# EasyEDA Pro project ProPrj_Frequency Generator for Healing_2026-01-01.epro

# Schematic ProPrj_Frequency Generator for Healing_2025-11-21
Board Name: ProPrj_Frequency Generator for Healing_2025-11-21; Create Date: 2025-11-24; Page Name: ProPrj_Frequency Generator for Healing_2025-11-21; Project Name: Frequency Generator for Healing; Schematic Name: ProPrj_Frequency Generator for Healing_2025-11-21; Update Date: 2025-12-26; File: ProPrj_Frequency Generator for Healing_2025-11-21; Id: /; Sheet: /
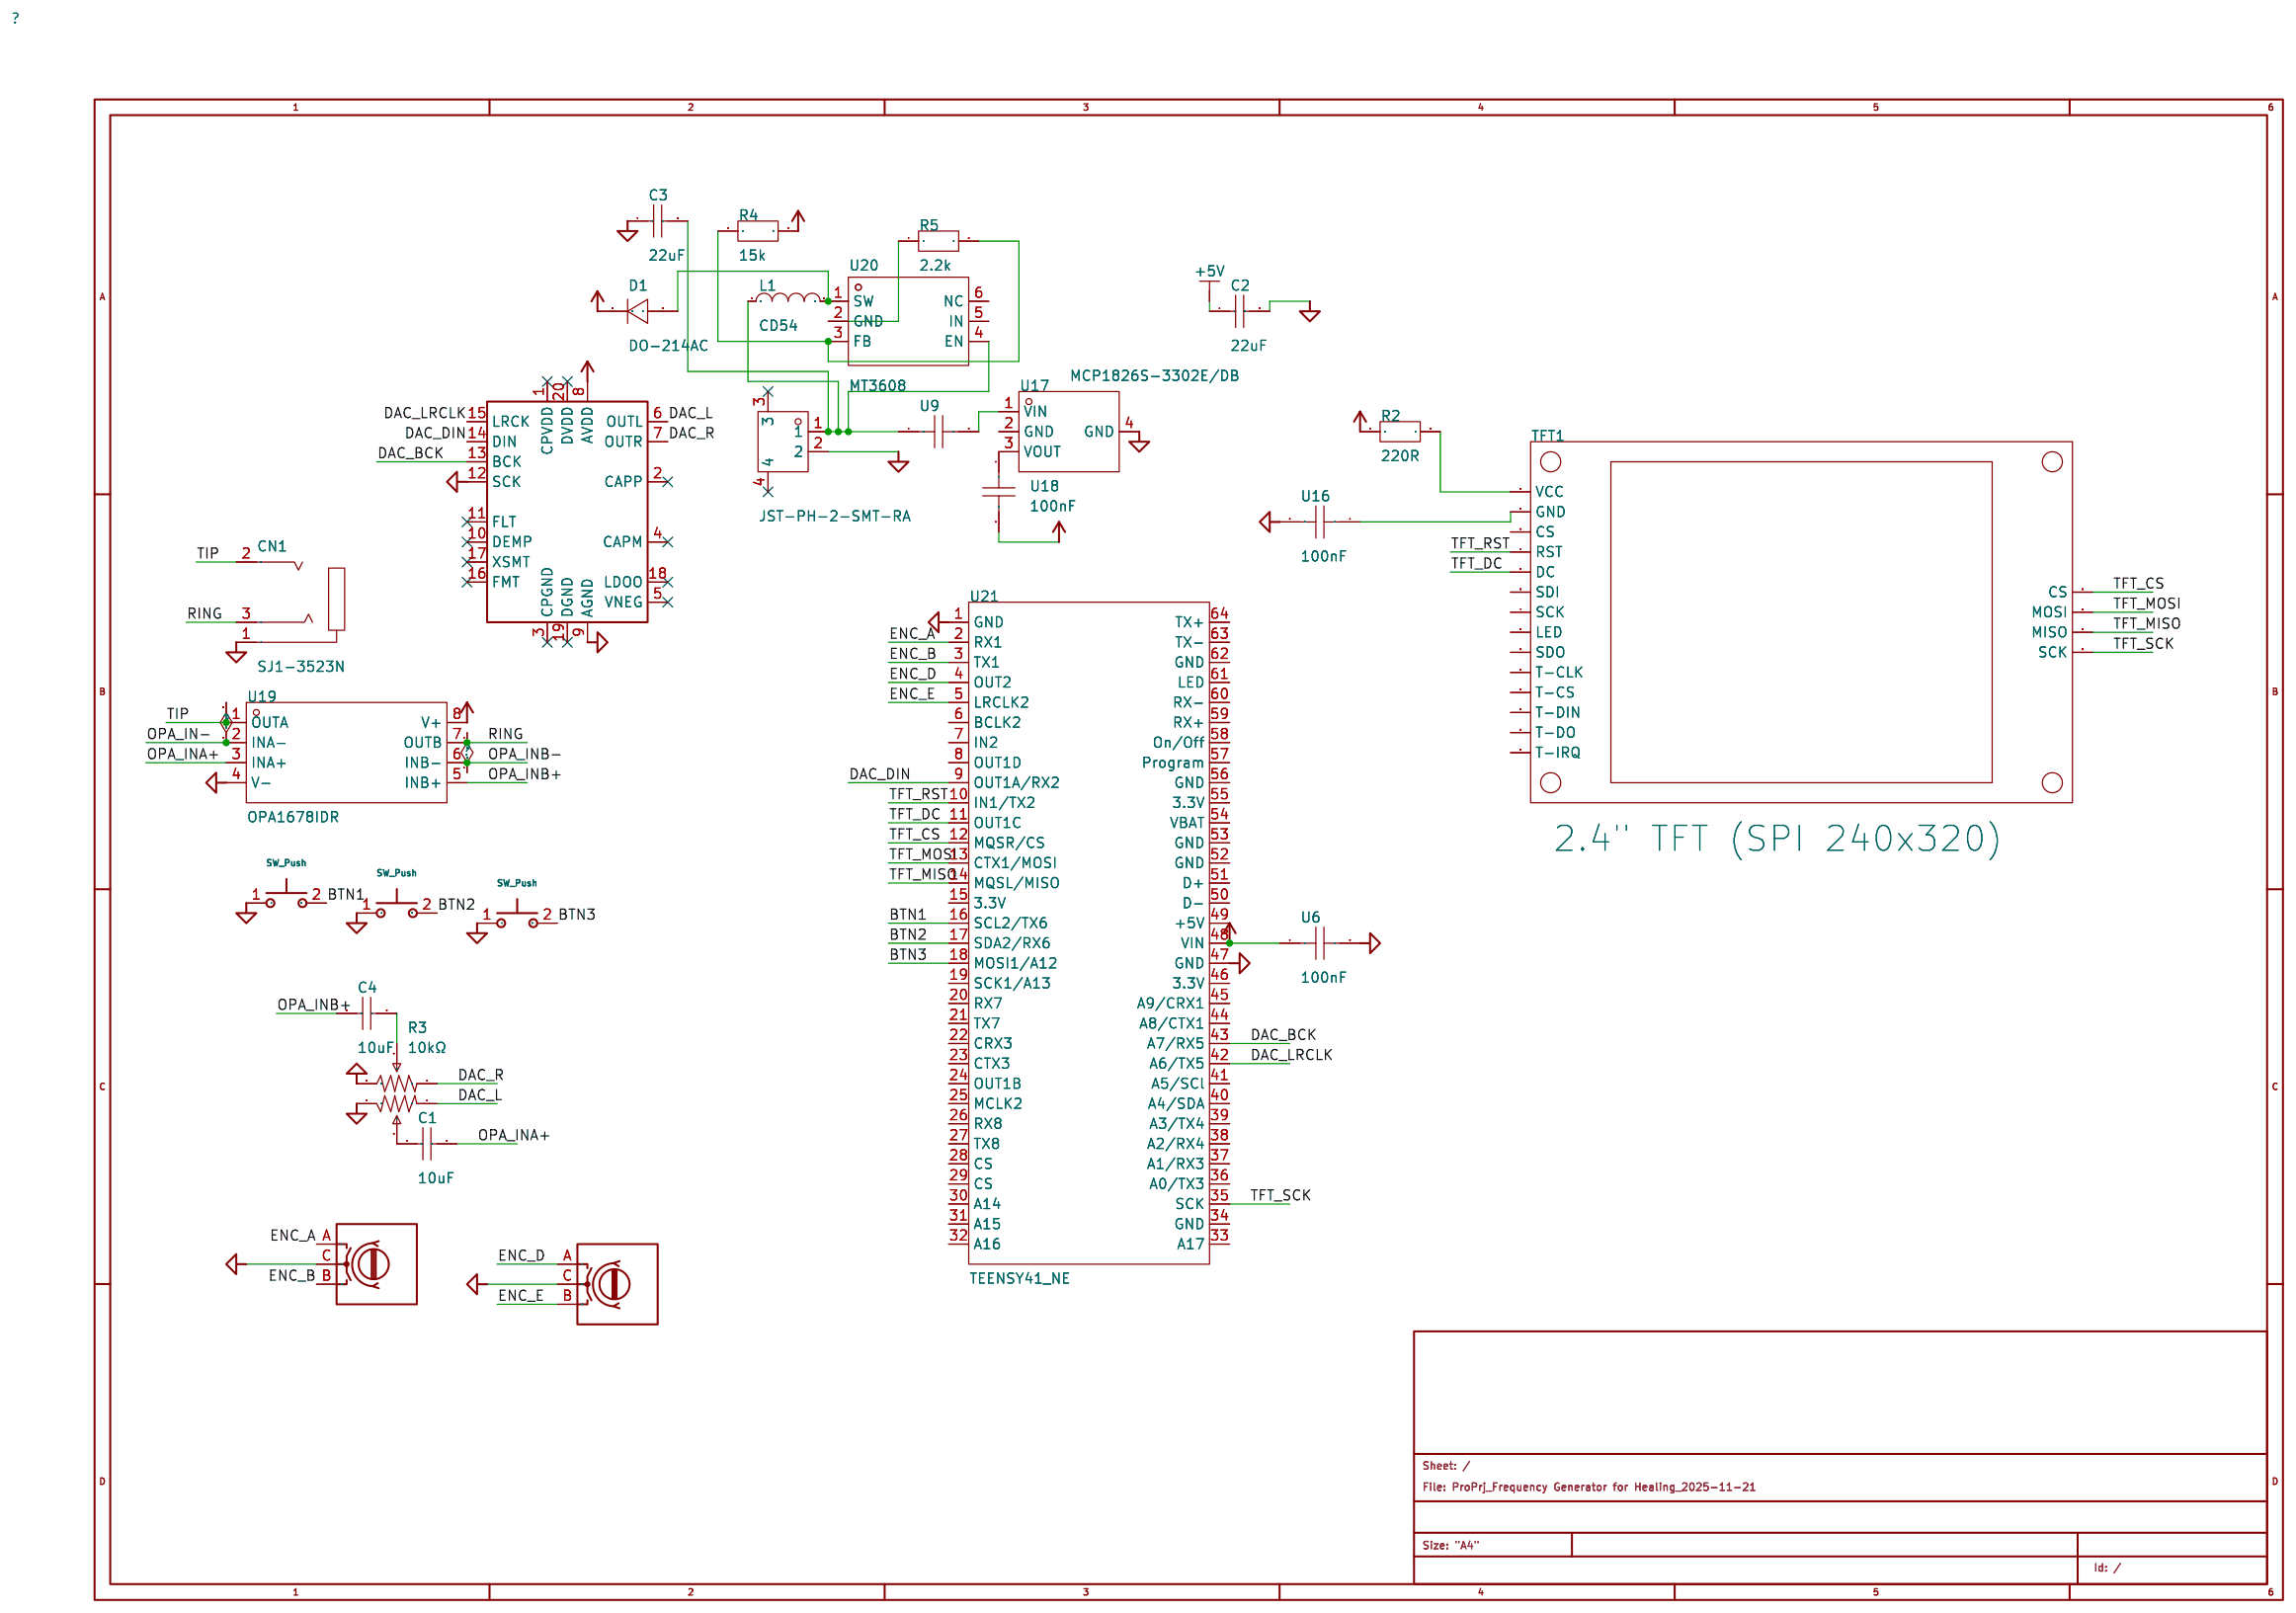
[diagram p0: schematic sheet]

## Parts
C1  10uF  [C1206]
C2  22uF  [C1206]
C3  22uF  [C1206]
C4  10uF  [C1206]
CN1  SJ1-3523N  [AUDIO-TH_SJ1-3523N]
CN2  JST-PH-2-SMT-RA  [CONN-SMD_JST-PH-2-SMT-RA]
D1  DO-214AC  [SMA_L4.3-W2.6-LS5.2-RD]
L1  CD54  [IND-SMD_L5.8-W5.2_CD54-4R7MT]
R2  220R  [R0603]
R3  10kΩ  [RES-ADJ-TH_RK097221005C]
R4  15k  [R0603]
R5  2.2k  [R0603]
SW1  EC110104S2A-VA1-006  [EC11-TH_EC110104S2A-VA1-006]
SW2  SW_Push  [SW-TH_4P-L7.2-W7.2-P4.50-S6.5_TC-02]
SW3  SW_Push  [SW-TH_4P-L7.2-W7.2-P4.50-S6.5_TC-02]
SW4  SW_Push  [SW-TH_4P-L7.2-W7.2-P4.50-S6.5_TC-02]
SW5  EC110104S2A-VA1-006  [EC11-TH_EC110104S2A-VA1-006]
TFT1  2.4" TFT (SPI 240x320)  [2.4_TFT_SPI_240x320]
U1  PCM5102APWR  [TSSOP-20_L6.5-W4.4-P0.65-LS6.4-BL]
U6  100nF  [C0603]
U9  C0603  [C0603]
U16  100nF  [C0603]
U17  MCP1826S-3302E/DB  [SOT-223-3_L6.7-W3.7-P2.30-LS7.0-BR]
U18  100nF  [C0603]
U19  OPA1678IDR  [SOIC-8_L5.0-W4.0-P1.27-LS6.0-BL]
U20  MT3608  [SOT-23-6_L2.9-W1.6-P0.95-LS2.8-BL]
U21  TEENSY41_NE  [COMM-TH_L60.1-W17.8-P2.54]

## Library data of the parts
C1-C4 = CL31A107MQHNNNE: Capacitance:100uF Tolerance:±20% Tolerance:±20% Voltage Rating:6.3V Temperature Coefficient:X5R; LCSC Part Name: 100uF ±20% 6.3V; Supplier Part: C15008; Manufacturer: SAMSUNG(三星); Supplier Footprint: 1206; JLCPCB Part Class: Basic Part; Datasheet: https://item.szlcsc.com/datasheet/CL31A107MQHNNNE/15681.html; Supplier: LCSC; Tolerance: ±20%; Voltage Rating: 6.3V; Temperature Coefficient: X5R
CN1 = SJ1-3523N: Supplier Part: C20182914; Manufacturer: CUI; JLCPCB Part Class: Extended Part; Datasheet: https://item.szlcsc.com/datasheet/SJ1-3523N/21508910.html; Supplier: LCSC
CN2 = JST-PH-2-SMT-RA: Supplier Part: C9900144926; Supplier Footprint: SMD; Supplier: LCSC
D1 = DO-214AC: Supplier Part: C9900026895; Supplier Footprint: SMA; JLCPCB Part Class: Extended Part; Supplier: LCSC
L1 = CD54: Supplier Part: C9900016766; JLCPCB Part Class: Extended Part; Supplier: LCSC
R2 R4 R5 = 1k: Supplier Part: C9900012840; JLCPCB Part Class: Extended Part; Supplier: LCSC
R3 = RK097221005C_1: Resistance:10kΩ Tolerance:±20% Tolerance:±20% Voltage Rating:- Power(Watts):- Number of Turns:-; LCSC Part Name: 10kΩ ±20%; Supplier Part: C470738; Manufacturer: ALPSALPINE(阿尔卑斯阿尔派); Manufacturer Part: RK097221005C; Supplier Footprint: 插件; Datasheet: https://atta.szlcsc.com/upload/public/pdf/source/20191216/C470759_F66FBF10924BEA4EB5A6234955541DDE.pdf; Supplier: LCSC; Tolerance: ±20%
SW1 SW5 = EC110104S2A-VA1-006: Supplier Part: C9900140894; Supplier Footprint: 无标准封装规格 EC11; Supplier: LCSC
SW2-SW4 = Switch_SW_Push: Push button switch, generic, two pins
TFT1 = 2.4_TFT_SPI_240x320
U1 = PCM5102APWR: Interface Type:PCM Supply Voltage:1.65V~3.46V Supply Voltage:1.65V~3.46V Number of Channels:2 Resolution:24；16；32 Operating Temperature:-25℃~+85℃ Operating Temperature:-25℃~+85℃; Supplier Part: C107671; Manufacturer: TI(德州仪器); Supplier Footprint: TSSOP-20; JLCPCB Part Class: Extended Part; Datasheet: https://www.ti.com/cn/lit/gpn/pcm5102a; Supplier: LCSC; Interface Type: PCM; Supply Voltage: 1.65V~3.46V; Number of Channels: 2; Resolution: 24；16；32; Operating Temperature: -25℃~+85℃
U6 U16 U18 = CT41G-0603-2X1-50V-0.1uF-K(N): Capacitance:100nF Tolerance:±10% Tolerance:±10% Voltage Rating:50V Temperature Coefficient:-; LCSC Part Name: 100nF ±10% 50V; Supplier Part: C125205; Manufacturer: TORCH(火炬); Supplier Footprint: 0603; JLCPCB Part Class: Extended Part; Datasheet: https://item.szlcsc.com/datasheet/CT41G-0603-2X1-50V-0.1uF-K(N)/136481.html; Supplier: LCSC; Tolerance: ±10%; Voltage Rating: 50V
U9 = C0603: Supplier Part: C9900029884; JLCPCB Part Class: Extended Part; Supplier: LCSC
U17 = MCP1826S-3302E/DB: Output Type:Fixed Voltage - Supply:6V Output Voltage:3.3V Output Voltage:3.3V Output Current:1A Power Supply Rejection Ratio (PSRR):60dB@(100Hz) Voltage Dropout:400mV@(1A) standby current:220uA Features:Short Circuit Protection；Over Temperature Protection; LCSC Part Name: 1000 mA，低压、低静态电流LDO稳压器; Supplier Part: C638624; Manufacturer: MICROCHIP(美国微芯); Supplier Footprint: SOT-223-3; JLCPCB Part Class: Extended Part; Datasheet: https://item.szlcsc.com/datasheet/MCP1826S-3302E%252FDB/668418.html; Supplier: LCSC; Output Type: Fixed; Voltage - Supply: 6V; Output Voltage: 3.3V; Output Current: 1A; Power Supply Rejection Ratio (PSRR): 60dB@(100Hz); Voltage Dropout: 400mV@(1A); standby current: 220uA; Features: Short Circuit Protection；Over Temperature Protection；Over Current Protection；Under Voltage Lockout; Operating Temperature: -40℃~+125℃; Output Configuration: Positive; Number of Outputs: 1
U19 = OPA1678IDR: LCSC Part Name: OPA167x 低失真音频运算放大器; Supplier Part: C192421; Manufacturer: TI(德州仪器); Supplier Footprint: SOIC-8-150mil; JLCPCB Part Class: Extended Part; Datasheet: https://www.ti.com/cn/lit/gpn/opa1678; Supplier: LCSC
U20 = MT3608: Function:Boost Output Type:Adjustable Voltage - Supply:2V~24V Voltage - Supply:2V~24V Output Voltage:- Output Voltage:- Output Current:2A Frequency - Switching:1.2MHz Frequency - Switching:1.2MHz Operating Temperature:-40℃~+85℃ Operating Temperature:-40℃~; LCSC Part Name: 老版本 高效1.2MHz 2A升压转换器; Supplier Part: C84817; Manufacturer: 西安航天民芯; Supplier Footprint: SOT-23-6; JLCPCB Part Class: Extended Part; Datasheet: https://item.szlcsc.com/datasheet/MT3608/85988.html; Supplier: LCSC; Function: Boost; Output Type: Adjustable; Voltage - Supply: 2V~24V; Output Current: 2A; Frequency - Switching: 1.2MHz; Operating Temperature: -40℃~+85℃; Synchronous Rectifier: No; Number of Outputs: 1; Topology: Boost; Quiescent Current: 100uA；1.6mA; Switch tube (built-in/external): Built-in
U21 = TEENSY41_NE: Supplier Part: C9900198559; Supplier Footprint: TH-59P; JLCPCB Part Class: Extended Part; Supplier: LCSC

## Nets
+5V: C2.1
BTN1: SW2.2 U21.16(SCL2/TX6)
BTN2: SW3.2 U21.17(SDA2/RX6)
BTN3: SW4.2 U21.18(MOSI1/A12)
DAC_BCK: U1.13(BCK) U21.43(A7/RX5)
DAC_DIN: U1.14(DIN) U21.9(OUT1A/RX2)
DAC_L: R3.1 U1.6(OUTL)
DAC_LRCLK: U1.15(LRCK) U21.42(A6/TX5)
DAC_R: R3.4 U1.7(OUTR)
ENC_A: SW1.A U21.2(RX1)
ENC_B: SW1.B SW1.C SW5.C U21.3(TX1)
ENC_D: SW5.A U21.4(OUT2)
ENC_E: SW5.B U21.5(LRCLK2)
OPA_IN-: CN1.2 U19.1(OUTA) U19.2(INA-)
OPA_INA+: C1.2 U19.3(INA+)
OPA_INB+: C4.1 U19.5(INB+)
OPA_INB-: CN1.3 U19.6(INB-) U19.7(OUTB)
POWER_+5V: D1.1 R2.1 R4.2 U1.8(AVDD) U6.1 U18.2 U19.8(V+) U21.48(VIN)
POWER_GND: C2.2 C3.1 CN1.1 CN2.2 R3.3 R3.6 SW2.1 SW3.1 SW4.1 U1.9(AGND) U1.12(SCK) U6.2 U16.2 U17.4(GND) U19.4(V-) U21.1(GND) U21.47(GND)
TFT_CS: TFT1.15(CS) U21.12(MQSR/CS)
TFT_DC: TFT1.5(DC) U21.11(OUT1C)
TFT_MISO: TFT1.17(MISO) U21.14(MQSL/MISO)
TFT_MOSI: TFT1.16(MOSI) U21.13(CTX1/MOSI)
TFT_RST: TFT1.4(RST) U21.10(IN1/TX2)
TFT_SCK: TFT1.18(SCK) U21.35(SCK)
$1N10167: R2.2 TFT1.1(VCC)
$1N10228: TFT1.2(GND) U16.1
$1N11020: U9.2 U17.1(VIN)
$1N11024: C3.2 CN2.1 L1.1 U9.1 U20.4(EN)
$1N11157: U17.3(VOUT) U18.1
$1N12872: D1.2 L1.2 U20.1(SW)
$1N13027: R4.1 R5.2 U20.3(FB)
$1N13199: C1.1 R3.2
$1N13278: R5.1 U20.2(GND)
$1N13723: C4.2 R3.5

Not connected (* = marked no-connect by the designer): CN2 3* 4*; TFT1 3(CS) 6(SDI) 7(SCK) 8(LED) 9(SDO) 10(T-CLK) 11(T-CS) 12(T-DIN) 13(T-DO) 14(T-IRQ); U1 1(CPVDD)* 2(CAPP)* 3(CPGND)* 4(CAPM)* 5(VNEG)* 10(DEMP)* 11(FLT)* 16(FMT)* 17(XSMT)* 18(LDOO)* 19(DGND)* 20(DVDD)*; U17 2(GND); U20 5(IN) 6(NC); U21 6(BCLK2) 7(IN2) 8(OUT1D) 15(3.3V) 19(SCK1/A13) 20(RX7) 21(TX7) 22(CRX3) 23(CTX3) 24(OUT1B) 25(MCLK2) 26(RX8) 27(TX8) 28(CS) 29(CS) 30(A14) 31(A15) 32(A16) 33(A17) 34(GND) 36(A0/TX3) 37(A1/RX3) 38(A2/RX4) 39(A3/TX4) 40(A4/SDA) 41(A5/SCl) 44(A8/CTX1) 45(A9/CRX1) 46(3.3V) 49(+5V) 50(D-) 51(D+) 52(GND) 53(GND) 54(VBAT) 55(3.3V) 56(GND) 57(Program) 58(On/Off) 59(RX+) 60(RX-) 61(LED) 62(GND) 63(TX-) 64(TX+)

# Board PCB2
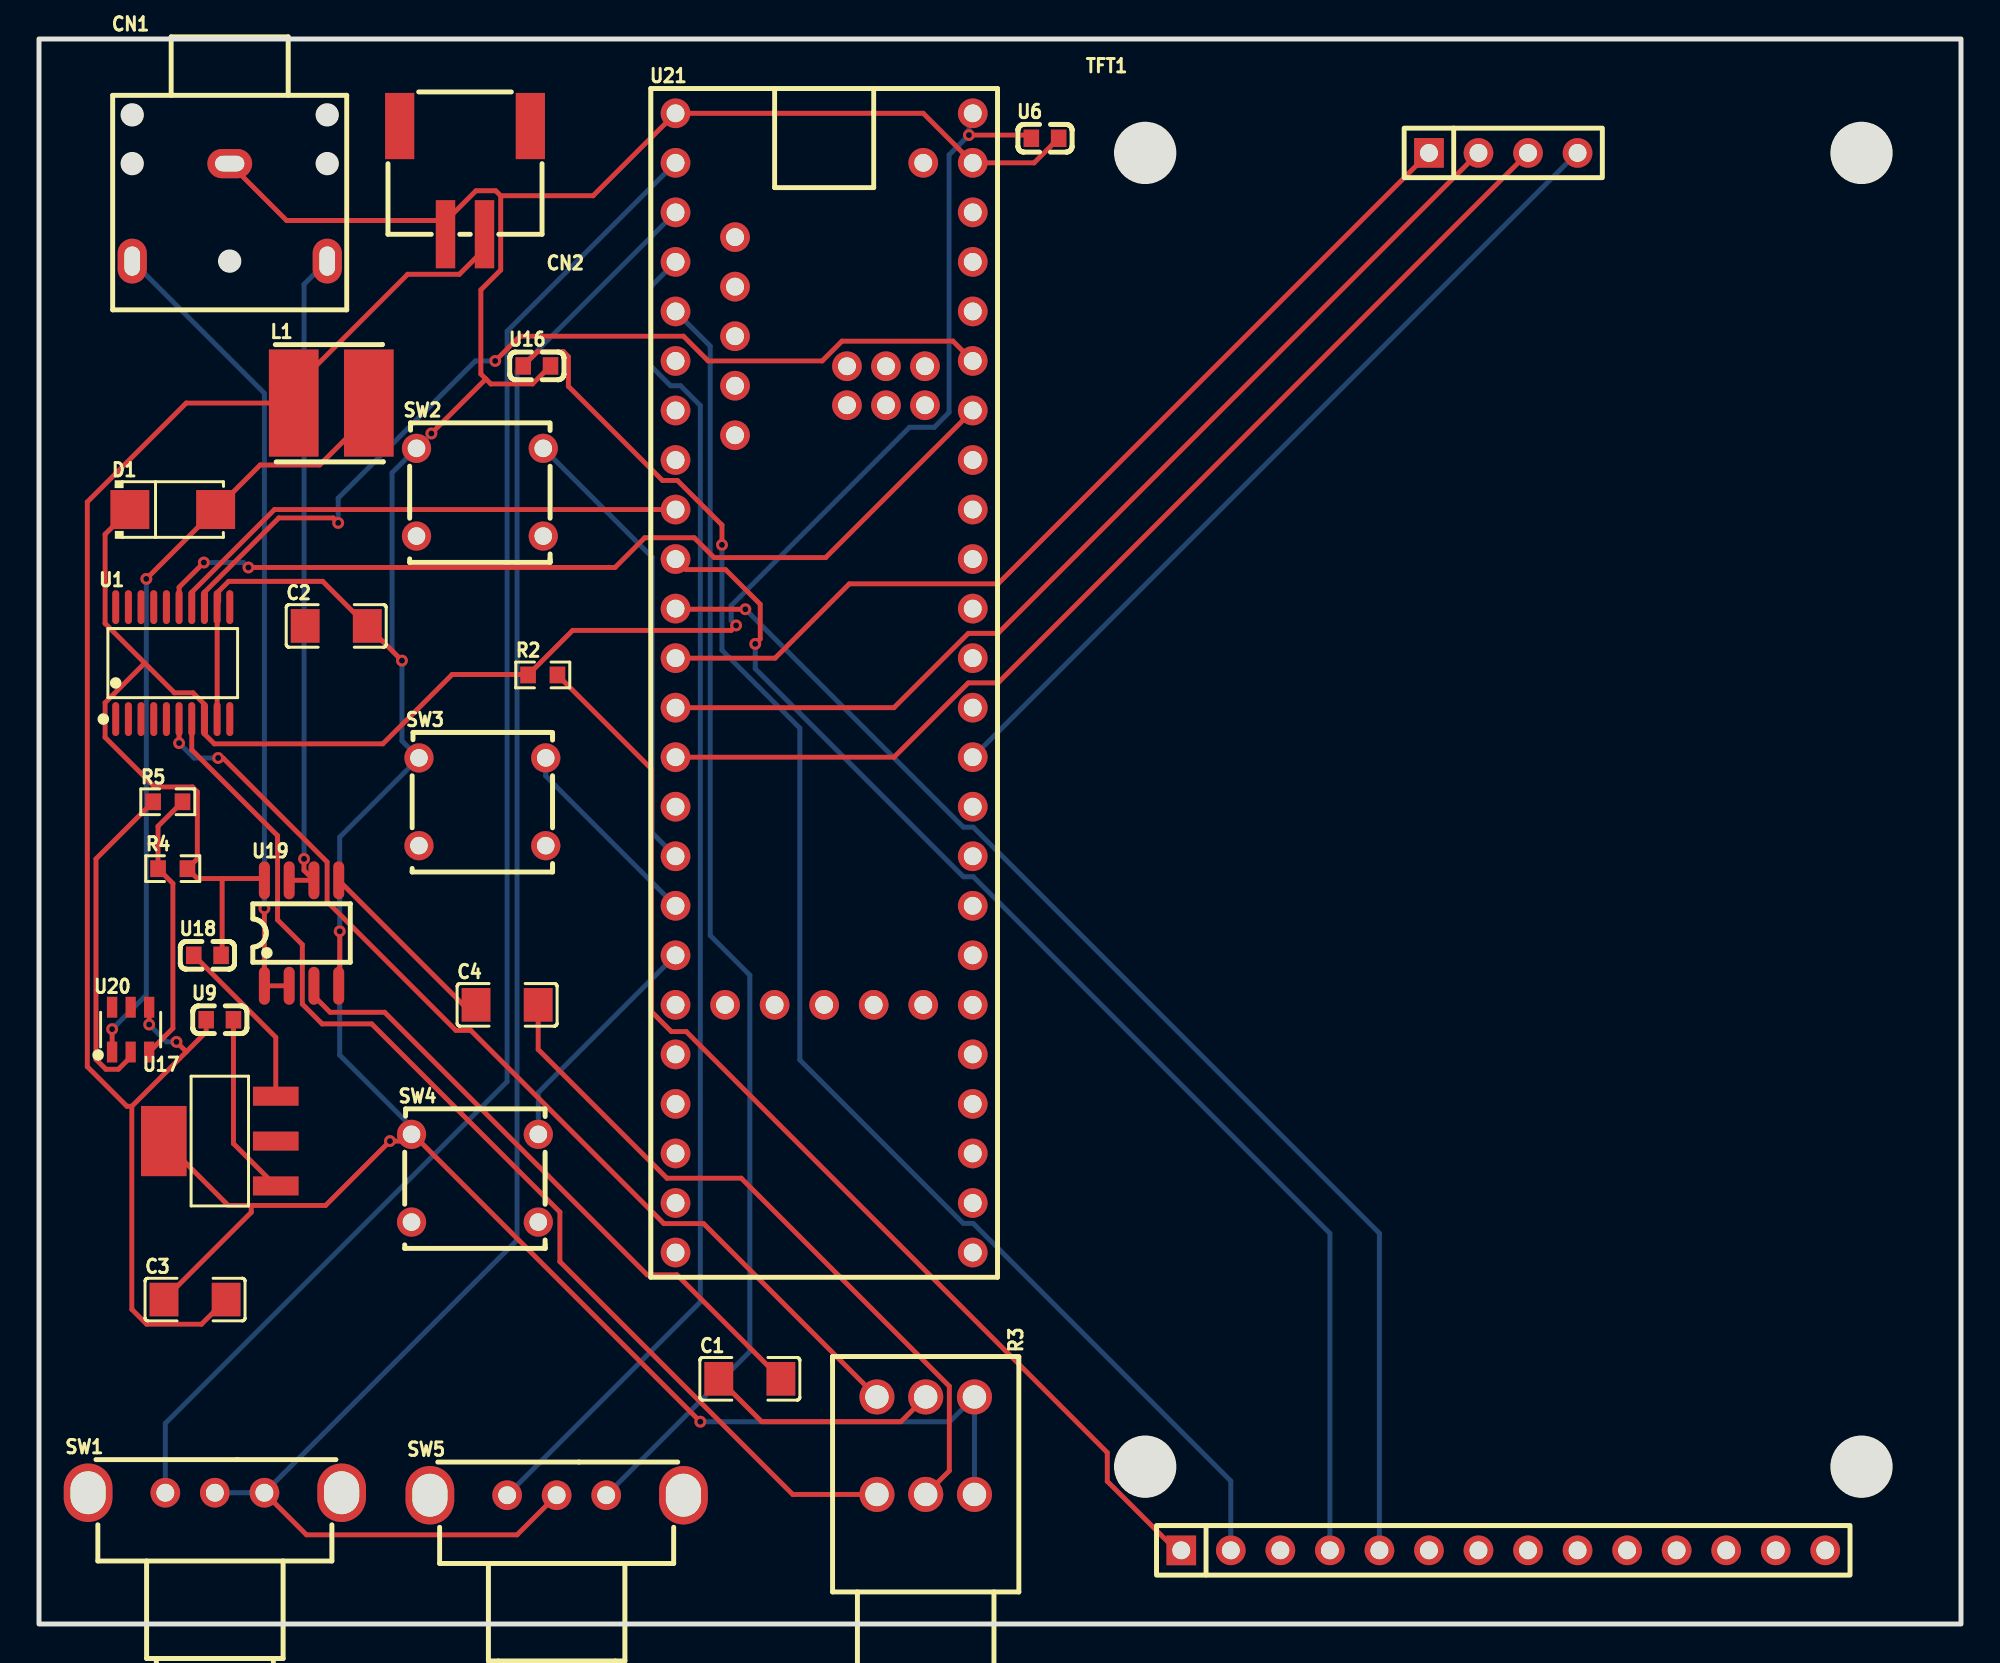
[diagram p1: board, top side]
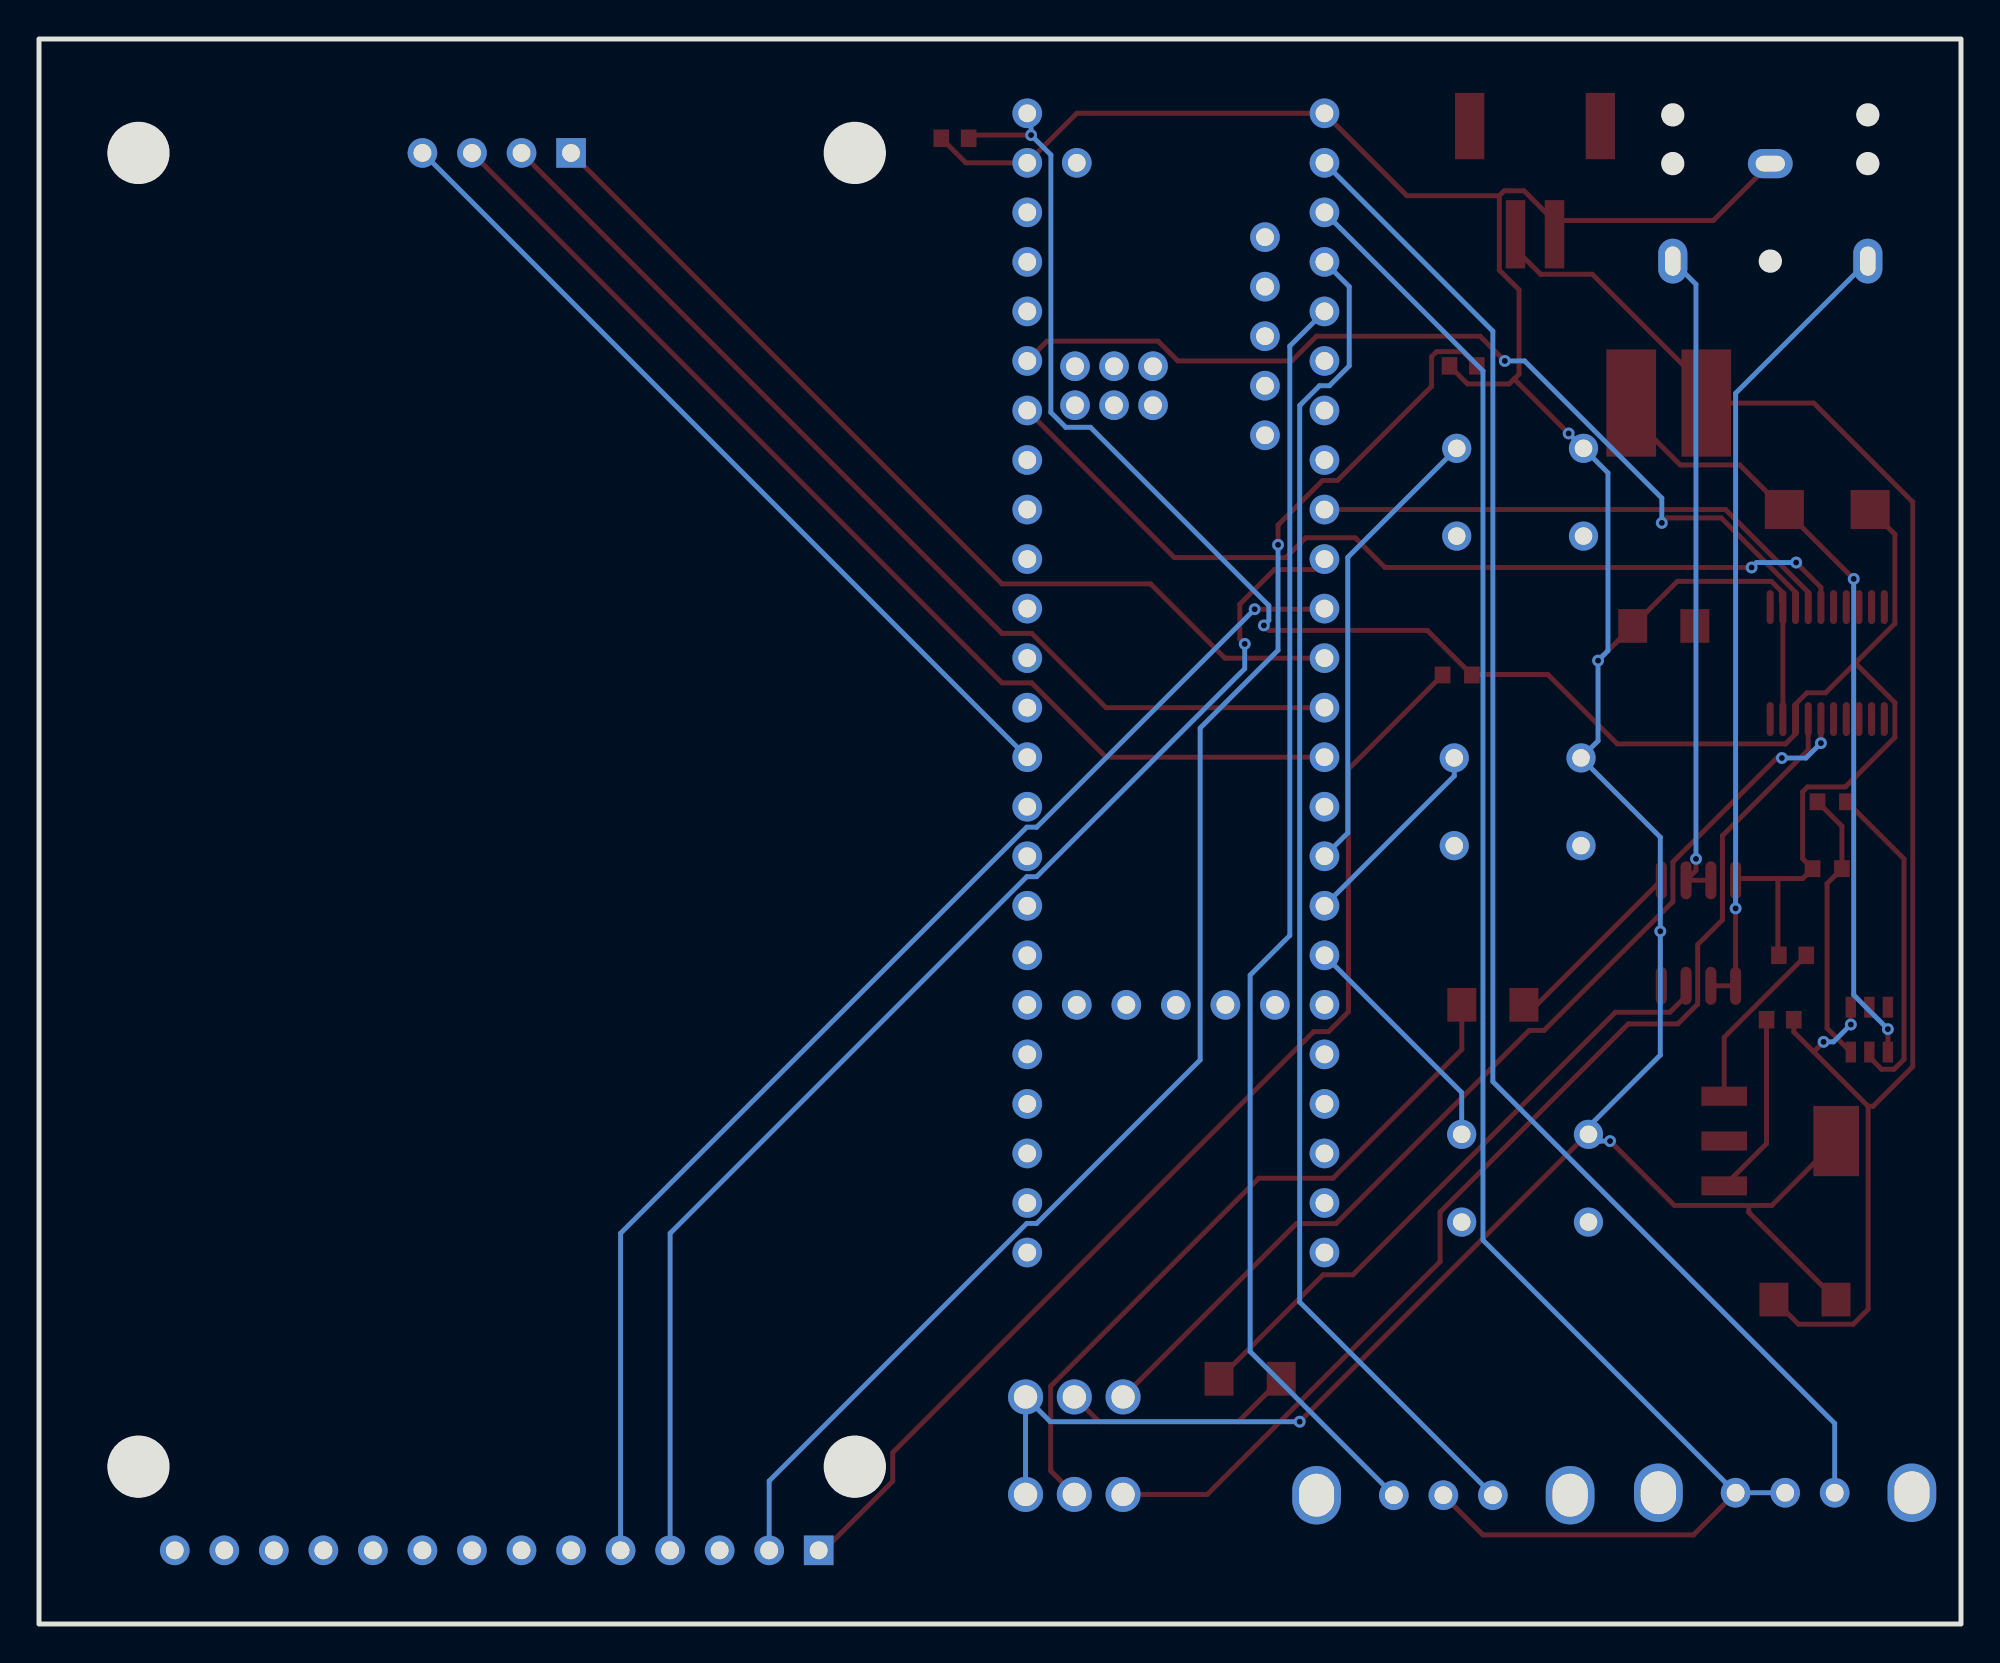
[diagram p2: board, bottom side, seen from below]

Outline 98.55 x 81.28 mm; copper layers: Top Layer, Bottom Layer. Coordinates in mm from the lower left corner of the outline.
Outline path: rectangle 0,81.28 98.55,0
Stack: Top Layer 0.035mm / Dielectric1 1.51mm FR4 er 4.5 / Bottom Layer 0.035mm

## Design rules (mm)
template: JLCPCB Capability(Two Layers Board)
spacing copperThickness1oz (default): track to track 0.102, other pairs 0.152 to 0.3
spacing copperThickness2oz: track to track 0.203, other pairs 0.152 to 0.3
track width copperThickness1oz (default): min 0.127, default 0.254, max 2.54
track width copperThickness2oz: min 0.203, default 0.254, max 2.54
differential pair differentialPair (default): width min 0.127, default 0.254, max 2.54; gap min 0.152, default 0.152
via viaSize (default): diameter min 0.5, default 0.61, max 10; hole min 0.3, default 0.305, max 6.3

## Placement (name value [footprint] x y rotation side)
C1  10uF  [C1206]  36.45 12.57 0 top
C2  22uF  [C1206]  15.24 51.18 0 top
C3  22uF  [C1206]  8 16.64 0 top
C4  10uF  [C1206]  24 31.75 0 top
CN1  SJ1-3523N  [AUDIO-TH_SJ1-3523N]  9.78 72.39 0 top
CN2  JST-PH-2-SMT-RA  [CONN-SMD_JST-PH-2-SMT-RA]  21.84 74.04 180 top
D1  DO-214AC  [SMA_L4.3-W2.6-LS5.2-RD]  6.86 57.15 0 top
L1  CD54  [IND-SMD_L5.8-W5.2_CD54-4R7MT]  14.99 62.61 0 top
R2  220R  [R0603]  25.83 48.67 0 top
R3  10kΩ  [RES-ADJ-TH_RK097221005C]  45.47 9.14 270 top
R4  15k  [R0603]  6.86 38.74 0 top
R5  2.2k  [R0603]  6.6 42.16 0 top
SW1  EC110104S2A-VA1-006  [EC11-TH_EC110104S2A-VA1-006]  9.02 6.73 0 top
SW2  SW_Push  [SW-TH_4P-L7.2-W7.2-P4.50-S6.5_TC-02]  22.61 58.04 0 top
SW3  SW_Push  [SW-TH_4P-L7.2-W7.2-P4.50-S6.5_TC-02]  22.73 42.16 0 top
SW4  SW_Push  [SW-TH_4P-L7.2-W7.2-P4.50-S6.5_TC-02]  22.35 22.86 0 top
SW5  EC110104S2A-VA1-006  [EC11-TH_EC110104S2A-VA1-006]  26.54 6.6 0 top
TFT1  2.4" TFT (SPI 240x320)  [2.4_TFT_SPI_240x320]  53.72 1.78 0 top
U1  PCM5102APWR  [TSSOP-20_L6.5-W4.4-P0.65-LS6.4-BL]  6.86 49.28 0 top
U6  100nF  [C0603]  51.58 76.19 0 top
U9  -  [C0603]  9.27 30.99 0 top
U16  100nF  [C0603]  25.53 64.52 0 top
U17  MCP1826S-3302E/DB  [SOT-223-3_L6.7-W3.7-P2.30-LS7.0-BR]  9.27 24.77 0 top
U18  100nF  [C0603]  8.64 34.29 0 top
U19  OPA1678IDR  [SOIC-8_L5.0-W4.0-P1.27-LS6.0-BL]  13.46 35.43 0 top
U20  MT3608  [SOT-23-6_L2.9-W1.6-P0.95-LS2.8-BL]  4.7 30.48 0 top
U21  TEENSY41_NE  [COMM-TH_L60.1-W17.8-P2.54]  40.26 48.26 0 top

## Footprints (pads in the part's own frame, mm; a bottom-side part is the same pattern mirrored in y, then rotated)
2.4_TFT_SPI_240x320
  rect 1.524x1.524 hole 0.914: 1(4.85,2) 15(17.55,73.66)
  round 1.524 hole 0.914: 2(7.39,2) 3(9.93,2) 4(12.47,2) 5(15.01,2) 6(17.55,2) 7(20.09,2) 8(22.63,2) 9(25.17,2) 10(27.71,2) 11(30.25,2) 12(32.79,2) 13(35.33,2) 14(37.87,2) 16(20.09,73.66) 17(22.63,73.66) 18(25.17,73.66)
AUDIO-TH_SJ1-3523N
  oval 2.3x1.5 hole 1.5x0.8: 1(0,2.5)
  oval 1.5x2.3 hole 0.8x1.5: 2(-5,-2.5) 3(5,-2.5)
C0603
  rect 0.8x0.9 smd: 1(-0.7,0) 2(0.7,0)
C1206
  rect 1.485x1.728 smd: 1(-1.593,0) 2(1.593,0)
COMM-TH_L60.1-W17.8-P2.54
  round 1.524 hole 0.914: 1(-7.62,29.21) 2(-7.62,26.67) 3(-7.62,24.13) 4(-7.62,21.59) 5(-7.62,19.05) 6(-7.62,16.51) 7(-7.62,13.97) 8(-7.62,11.43) 9(-7.62,8.89) 10(-7.62,6.35) 11(-7.62,3.81) 12(-7.62,1.27) 13(-7.62,-1.27) 14(-7.62,-3.81) 15(-7.62,-6.35) 16(-7.62,-8.89) 17(-7.62,-11.43) 18(-7.62,-13.97) 19(-7.62,-16.51) 20(-7.62,-19.05) 21(-7.62,-21.59) 22(-7.62,-24.13) 23(-7.62,-26.67) 24(-7.62,-29.21) 25(7.62,-29.21) 26(7.62,-26.67) 27(7.62,-24.13) 28(7.62,-21.59) 29(7.62,-19.05) 30(7.62,-16.51) 31(7.62,-13.97) 32(7.62,-11.43) 33(7.62,-8.89) 34(7.62,-6.35) 35(7.62,-3.81) 36(7.62,-1.27) 37(7.62,1.27) 38(7.62,3.81) 39(7.62,6.35) 40(7.62,8.89) 41(7.62,11.43) 42(7.62,13.97) 43(7.62,16.51) 44(7.62,19.05) 45(7.62,21.59) 46(7.62,24.13) 47(7.62,26.67) 48(7.62,29.21) 49(-4.57,22.86) 50(-4.57,20.32) 51(-4.57,17.78) 52(-4.57,15.24) 53(-4.57,12.7) 54(-5.08,-16.51) 55(-2.54,-16.51) 56(0,-16.51) 57(2.54,-16.51) 58(5.08,-16.51) 59(5.17,16.24) 60(5.17,14.24) 61(3.17,16.24) 62(3.17,14.24) 63(1.17,16.24) 64(1.17,14.24) 65(5.08,26.67)
CONN-SMD_JST-PH-2-SMT-RA
  rect 1x3.5 smd: 1(-1,2.775) 2(1,2.775)
  rect 1.5x3.4 smd: 3(-3.35,-2.775) 4(3.35,-2.775)
EC11-TH_EC110104S2A-VA1-006
  oval 2.5x3 hole 1.8x2.2: 4(6.5,0) 5(-6.5,0)
  round 1.524 hole 0.914: A(-2.54,0) B(2.54,0) C(0,0)
IND-SMD_L5.8-W5.2_CD54-4R7MT
  rect 2.55x5.5 smd: 1(-1.925,0) 2(1.925,0)
R0603
  rect 0.806x0.864 smd: 1(-0.753,0) 2(0.753,0)
RES-ADJ-TH_RK097221005C
  round 1.8 hole 1.2: 1(-2.5,-2.5) 2(-2.5,0) 3(-2.5,2.5) 4(2.5,-2.5) 5(2.5,0) 6(2.5,2.5)
SMA_L4.3-W2.6-LS5.2-RD
  rect 2x2 smd: 1(-2.2,0) 2(2.2,0)
SOIC-8_L5.0-W4.0-P1.27-LS6.0-BL
  oval 0.569x1.95 smd: 1(-1.905,-2.705) 2(-0.635,-2.705) 3(0.635,-2.705) 4(1.905,-2.705) 5(1.905,2.705) 6(0.635,2.705) 7(-0.635,2.705) 8(-1.905,2.705)
SOT-23-6_L2.9-W1.6-P0.95-LS2.8-BL
  rect 0.532x1.072 smd: 1(-0.95,-1.149) 2(0,-1.149) 3(0.95,-1.149) 4(0.95,1.149) 5(0,1.149) 6(-0.95,1.149)
SOT-223-3_L6.7-W3.7-P2.30-LS7.0-BR
  rect 2.34x0.98 smd: 1(2.87,-2.3) 2(2.87,0) 3(2.87,2.3)
  rect 2.34x3.6 smd: 4(-2.87,0)
SW-TH_4P-L7.2-W7.2-P4.50-S6.5_TC-02
  round 1.5 hole 0.9: 1(-3.25,2.25) 2(3.25,2.25) 3(-3.25,-2.25) 4(3.25,-2.25)
TSSOP-20_L6.5-W4.4-P0.65-LS6.4-BL
  oval 0.364x1.742 smd: 1(-2.925,-2.871) 2(-2.275,-2.871) 3(-1.625,-2.871) 4(-0.975,-2.871) 5(-0.325,-2.871) 6(0.325,-2.871) 7(0.975,-2.871) 8(1.625,-2.871) 9(2.275,-2.871) 10(2.925,-2.871) 11(2.925,2.871) 12(2.275,2.871) 13(1.625,2.871) 14(0.975,2.871) 15(0.325,2.871) 16(-0.325,2.871) 17(-0.975,2.871) 18(-1.625,2.871) 19(-2.275,2.871) 20(-2.925,2.871)

## Nets
As in the schematic.

Pads without a net: CN2 3 4; SW1 4 5; SW2 3 4; SW3 3 4; SW4 3 4; SW5 4 5; TFT1 3 6 7 8 9 10 11 12 13 14; U1 1 2 3 4 5 10 11 16 17 18 19 20; U17 2; U20 5 6; U21 6 7 8 15 19 20 21 22 23 24 25 26 27 28 29 30 31 32 33 34 36 37 38 39 40 41 44 45 46 49 50 51 52 53 54 55 56 57 58 59 60 61 62 63 64 65

## Via types
v1: diameter 0.61, hole 0.305, Top Layer to Bottom Layer, 22 vias

## Routing (per net, layer and track width the routed paths; a pad name or vN(x,y) marks a point on that pad's centre or on a via; arc(x,y) is an arc through that point)
BTN1: length 23.7
  Bottom Layer w0.254: U21.16 31.44,40.57 31.44,54.7 SW2.2
BTN2: length 10.3
  Bottom Layer w0.254: U21.17 25.98,43.49 SW3.2
BTN3: length 12.1
  Bottom Layer w0.254: U21.18 25.6,27.25 SW4.2
DAC_BCK: length 47.9
  Top Layer w0.254: U21.43 46.86,65.79 41.17,65.79 40.16,64.77 34.31,64.77 33.04,66.04 24.66,66.04 v1(23.39,64.77) ; 8.48,52.15 8.48,52.91 12.29,56.72 15.09,56.72 v1(15.34,56.47)
  Bottom Layer w0.254: v1(23.39,64.77) 22.38,64.77 15.34,57.74 v1(15.34,56.47)
DAC_DIN: length 27.3
  Top Layer w0.254: U21.9 12.07,57.15 7.83,52.91 7.83,52.15
DAC_L: length 52.1
  Top Layer w0.254: v1(7.18,45.17) U1.6 ; R3.1 34.08,20.53 32.04,20.53 22.14,30.44 21.38,30.44 14.77,37.04 14.77,39.08 9.44,44.41 v1(9.18,44.41)
  Bottom Layer w0.254: v1(7.18,45.17) 7.95,44.41 v1(9.18,44.41)
DAC_LRCLK: length 46.5
  Top Layer w0.254: v1(8.45,54.43) 7.18,53.16 7.18,52.15 ; U21.42 40.34,54.69 34.61,54.69 33.6,55.7 31.06,55.7 29.54,54.18 v1(10.74,54.18)
  Bottom Layer w0.254: v1(10.74,54.18) 10.48,54.43 v1(8.45,54.43)
DAC_R: length 58.3
  Top Layer w0.254: R3.4 38.65,6.64 26.71,18.58 26.71,21.12 17.06,30.77 14.52,30.77 13.5,31.79 13.5,34.84 12.23,36.11 12.23,40.43 7.83,44.83 U1.7
ENC_A: length 79
  Bottom Layer w0.254: U21.2 24,66.29 24,27.81 6.48,10.29 SW1.A
ENC_B: length 93.7
  Top Layer w0.254: SW5.C 24.51,4.57 13.72,4.57 SW1.B
  Bottom Layer w0.254: U21.3 24.51,64.26 24.51,19.69 SW1.B SW1.C
ENC_D: length 69.2
  Bottom Layer w0.254: U21.4 31.37,68.58 31.37,64.52 32.39,63.5 32.89,63.5 33.91,62.48 33.91,16.51 SW5.A
ENC_E: length 65.3
  Bottom Layer w0.254: U21.5 34.42,65.53 34.42,35.31 36.45,33.27 36.45,13.97 29.08,6.6
OPA_IN-: length 41.2
  Top Layer w0.254: v1(11.56,36.7) U19.1 U19.2
  Bottom Layer w0.254: CN1.2 11.56,63.11 v1(11.56,36.7)
OPA_INA+: length 32.6
  Top Layer w0.254: C1.2 32.71,17.91 31.18,17.91 17.72,31.37 14.93,31.37 14.1,32.2 U19.3
OPA_INB+: length 9.7
  Top Layer w0.254: C4.1 21.76,31.75 U19.5
OPA_INB-: length 33.7
  Top Layer w0.254: U19.7 U19.6 13.59,38.65 v1(13.59,39.24)
  Bottom Layer w0.254: v1(13.59,39.24) 13.59,68.7 CN1.3
POWER_+5V: length 103.1
  Top Layer w0.254: v1(47.68,76.35) 50.72,76.35 U6.1 ; 9.39,38.23 11.47,38.23 U19.8 ; 9.39,38.23 9.39,34.34 U18.2 ; 9.39,38.23 8.12,38.23 R4.2 8.12,39.24 8.12,42.67 7.87,42.93 5.93,42.93 3.39,45.47 3.39,47.24 5.42,49.28 ; 5.42,49.28 6.94,47.75 7.9,47.75 8.48,47.17 U1.8 8.48,45.64 8.99,45.14 17.63,45.14 21.18,48.69 25.05,48.69 25.08,48.67 27.36,50.95 35.49,50.95 v1(35.74,51.21) ; 5.42,49.28 3.39,51.31 3.39,55.88 D1.1
  Bottom Layer w0.254: v1(35.74,51.21) 35.49,51.46 35.49,52.22 44.64,61.37 45.91,61.37 46.67,62.13 46.67,75.34 v1(47.68,76.35) 47.68,77.27 U21.48
POWER_GND: length 191.1
  Top Layer w0.254: 23.67,73.24 28.41,73.24 U21.1 45.34,77.47 U21.47 51.02,74.93 U6.2 ; 23.67,73.24 23.67,69.43 22.66,68.42 22.66,64.1 22.91,63.85 ; 23.67,73.24 23.42,73.5 22.4,73.5 20.88,71.97 ; 20.88,71.97 20.88,71.3 CN2.2 ; 20.88,71.97 12.7,71.97 CN1.1 ; 6.4,24.77 9.7,21.46 10.88,21.46 ; 10.88,21.46 10.88,21.11 C3.1 ; 10.88,21.46 14.69,21.46 v1(18,24.77) 19.52,24.77 v1(33.91,10.37) ; U19.4 15.42,32.78 v1(15.42,35.52) ; 22.91,63.85 23.17,63.59 25.3,63.59 U16.2 ; 22.91,63.85 v1(20.12,61.05) ; U1.9 9.13,52.37 9.21,52.45 9.21,52.96 9.72,53.47 14.55,53.47 C2.2 v1(18.61,49.4)
  Bottom Layer w0.254: 18.98,25.24 18.98,25.62 15.42,29.17 v1(15.42,35.52) 15.42,40.35 SW3.1 18.61,45.29 v1(18.61,49.4) 18.1,49.91 18.1,59.04 SW2.1 v1(20.12,61.05) ; 18.98,25.24 18.5,24.77 v1(18,24.77) ; 18.98,25.24 SW4.1 ; v1(33.91,10.37) 46.7,10.37 R3.3 R3.6
TFT_CS: length 49.4
  Top Layer w0.254: 71.27,75.44 49.17,53.34 41.55,53.34 37.74,49.53 U21.12
TFT_DC: length 65.6
  Top Layer w0.254: v1(36.22,52.04) 32.67,52.04 U21.11
  Bottom Layer w0.254: TFT1.5 68.73,20.03 47.9,40.86 47.39,40.86 v1(36.22,52.04)
TFT_MISO: length 56.5
  Top Layer w0.254: TFT1.17 49.17,48.26 47.65,48.26 43.84,44.45 U21.14
TFT_MOSI: length 53
  Top Layer w0.254: U21.13 43.84,46.99 47.65,50.8 49.17,50.8 73.81,75.44
TFT_RST: length 66.4
  Top Layer w0.254: v1(36.73,50.26) 36.98,50.51 36.98,52.29 35.2,54.07 33.18,54.07 U21.10
  Bottom Layer w0.254: v1(36.73,50.26) 36.73,48.99 47.39,38.32 47.9,38.32 66.19,20.03 TFT1.4
TFT_SCK: length 43.8
  Bottom Layer w0.254: 78.89,75.44 78.87,75.44 U21.35
$1N10167: length 58.7
  Top Layer w0.254: R2.2 31.41,43.84 31.41,31.4 32.43,30.38 33.19,30.38 54.78,8.79 54.78,7.32 58.32,3.78 TFT1.1
$1N10228: length 78.8
  Top Layer w0.254: U16.1 25.56,65.25 26.89,65.25 27.15,64.99 27.15,63.47 31.97,58.64 32.73,58.64 35.02,56.36 v1(35.02,55.34)
  Bottom Layer w0.254: TFT1.2 61.11,7.33 47.9,20.54 47.39,20.54 39.01,28.92 39.01,45.94 35.02,49.94 v1(35.02,55.34)
$1N11020: length 9.4
  Top Layer w0.254: U17.1 9.97,24.64 U9.2
$1N11024: length 84.5
  Top Layer w0.254: C3.2 8.33,15.37 5.52,15.37 4.76,16.14 4.76,26.55 ; U9.1 8.57,30.36 7.56,29.34 ; CN2.1 22.83,71.25 22.83,70.49 21.56,69.22 18.9,69.22 13.06,63.37 L1.1 7.55,62.61 2.48,57.54 2.48,28.58 4.51,26.55 4.76,26.55 ; v1(5.65,30.74) U20.4 ; 4.76,26.55 7.56,29.34 ; 7.56,29.34 v1(7.05,29.85)
  Bottom Layer w0.254: v1(7.05,29.85) 6.54,29.85 v1(5.65,30.74)
$1N11157: length 9
  Top Layer w0.254: U17.3 12.14,30.09 U18.1
$1N12872: length 40.5
  Top Layer w0.254: L1.2 16.91,61.96 14.39,59.44 11.34,59.44 D1.2 v1(5.5,53.59) ; v1(3.75,30.51) 3.75,29.33
  Bottom Layer w0.254: v1(3.75,30.51) 5.5,32.26 v1(5.5,53.59)
$1N13027: length 14.2
  Top Layer w0.254: U20.3 6.87,30.55 6.87,37.97 R4.1 6.1,40.91 R5.2
$1N13199: length 12
  Top Layer w0.254: C1.1 37.06,10.37 44.2,10.37 R3.2
$1N13278: length 16.9
  Top Layer w0.254: U20.2 4.7,29.08 4.07,28.45 3.43,28.45 2.92,28.96 2.92,39.23 R5.1
$1N13723: length 36.6
  Top Layer w0.254: C4.2 25.6,29.46 32.2,22.86 36.01,22.86 46.68,12.19 46.68,7.86 R3.5
